# EAGLE design ncp1117 (EAGLE 7.2.0)
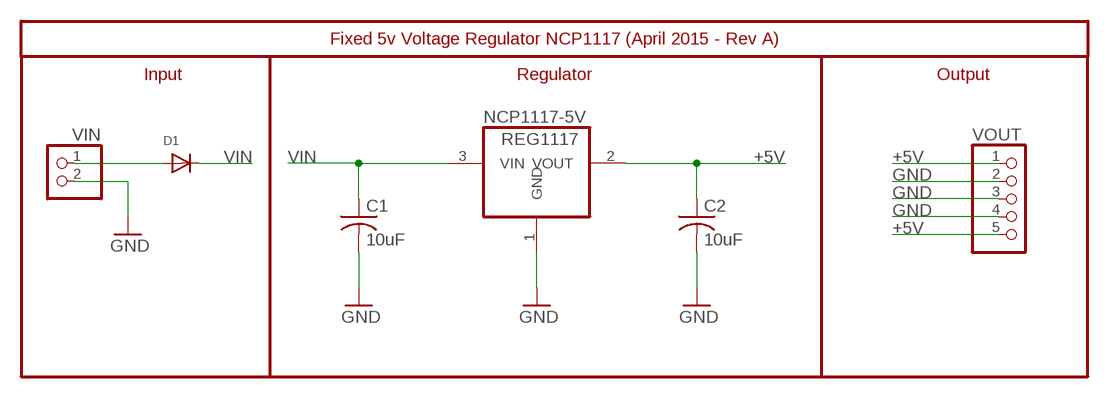
[diagram p0: schematic, sheet 1]

## Parts
C1  10uF  C-USC0805  [C0805]
C2  10uF  C-USC0805  [C0805]
D1  DIODESMA  [SMADIODE]
NCP1117-5V  REG1117  [SOT223]
VIN  PINHD-1X2  [1X02]
VOUT  PINHD-1X5  [1X05]

## Nets
+5V: C2.1 NCP1117-5V.2(VOUT) VOUT.1 VOUT.5
GND: C1.2 C2.2 NCP1117-5V.1(GND) VIN.2 VOUT.2 VOUT.3 VOUT.4
N$1: D1.A VIN.1
VIN: C1.1 D1.C NCP1117-5V.3(VIN)

## Notes on the sheet
- Fixed 5v Voltage Regulator NCP1117 (April 2015 - Rev A)
- Input | Regulator | Output

## Library data of the parts
C1 C2 = resistor:C-US: CAPACITOR, American symbol
D1 = adafruit:DIODE: Diode SMADIODE - SMA Surface Mount Package 20V 1A Schottky Diode Digikey: 641-1014-6-ND DO-1N4148 - Through Hole Small Current Diode SOD-123 20V 1 A (.5mV Vf) Schottky Diode - Digikey: MBRX120TPMSCT-ND SOD-323 10V 570mA (.38mV Vf, 3ns) Schottky Diode - Digikey: ZLLS410CT-ND SOD-523 30V 30mA Schottky Diode (RB751S-40TE61) - Digikey: RB751S-40TE61CT-ND SOT23-R/W - SOT23 Package (R = Solder Paste/Reflow Ovens, W = Hand-Soldering) BAT54Film 40V 300mA - Digikey: 497-7162-1-ND
NCP1117-5V = burr-brown:REG1117: 800mA and 1A Low Dropout (LDO) Positive Regulator 1.8V, 2.5V, 2.85V, 3.3V, 5V, and Adj; MPN: REG1117; OC_FARNELL: 1097566; OC_NEWARK: 14P6981
VIN = pinhead:PINHD-1X2: PIN HEADER
VOUT = pinhead:PINHD-1X5: PIN HEADER

## Board
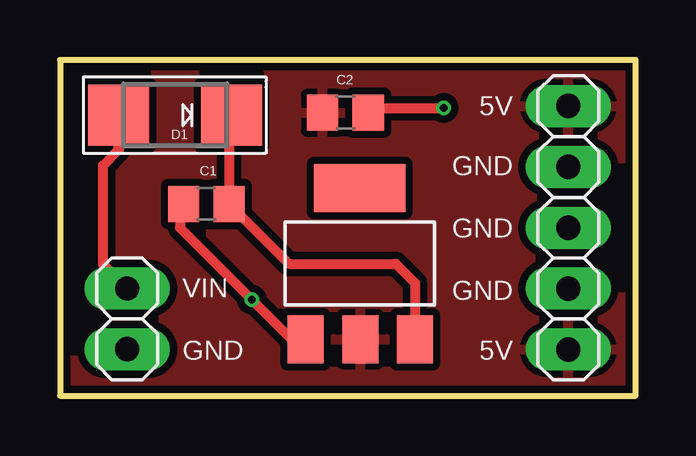
[diagram p1: board, top side]
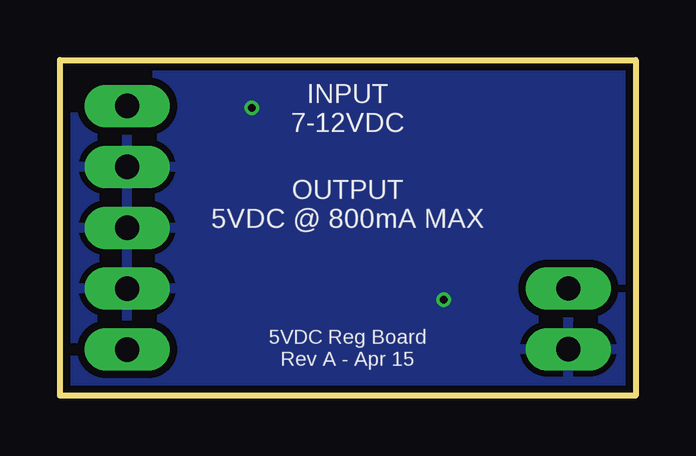
[diagram p2: board, bottom side, seen from below]

Size 24 x 14 mm. Coordinates in mm from the lower left corner, seen from the top.
Outline: 0,14 0,0 24,0 24,14 0,14
Copper layers (1*16): Top 0.035mm / dielectric 1.5mm / Bottom 0.035mm
Design rules "dirt_cheap_dirty_boards.v1 *": minimum track width 5mil, minimum drill 12mil, track to track 10mil, track to pad 10mil, pad to pad 10mil, via to via 7mil, smd to smd 0mil, copper to edge 10mil, drill to drill 10mil, minimum pad ring 15mil, minimum via ring 6mil, stop-mask expansion 2mil, vias tented up to drill 25mil, thermal gap 10mil

### Footprints (pad centres in the part's own frame; a part is rotated, then mirrored left to right if it is on the bottom)
C0805 = smd 1.3 x 1.5: 1 -0.95,0; 2 0.95,0
SMADIODE = smd 2.54 x 2.54: A 2.349,0; C -2.349,0
SOT223 = smd 1.499 x 2.007: 1 -2.261,-3.15; 2 0.025,-3.15; 3 2.311,-3.15 | smd 3.81 x 2.007: 4 0,3.15
1X02 = drill 1.016 long: 1 -1.27,0; 2 1.27,0
1X05 = drill 1.016 long: 1 -5.08,0; 2 -2.54,0; 3 0,0; 4 2.54,0; 5 5.08,0

### Placement (x,y rotation side)
C1  6.1,8 180 top
C2  11.9,11.8 0 top
D1  4.8,11.7 180 top
NCP1117-5V  12.5,5.5 0 top
VIN  2.8,3.2 270 top
VOUT  21.2,7 270 top

### Tracks (layer width: path | path; a pad name or v marks a point on that pad's centre or on a via)
+5V
  pour Top (isolate 0.305): 0,14 24,14 24,0 0,0
GND  (via drill 0.3)
  Top 0.406: C2.2 13.05,12 v16,12 | C1.2 5,7.85 5,7 v8,4 9.65,2.35 NCP1117-5V.1
  pour Bottom (isolate 0.305): 0,14 24,14 24,0 0,0
N$1
  Top 0.406: VIN.1 1.8,5.47 1.8,9.6 2.45,10.25 D1.A
VIN
  Top 0.406: D1.C 7.05,11.6 C1.1 9.55,5.5 14,5.5 14.81,4.69 NCP1117-5V.3

### Text on the board
tPlace: 5V | GND | GND | VIN | GND | GND | 5V
bPlace: INPUT / 7-12VDC | OUTPUT / 5VDC @ 800mA MAX | 5VDC Reg Board / Rev A - Apr 15